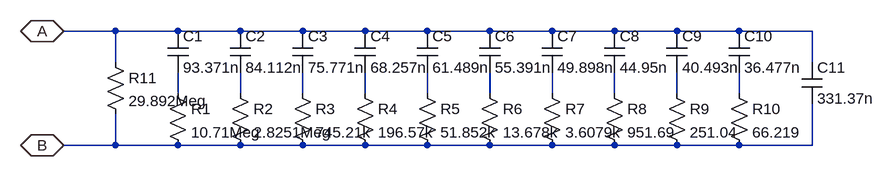
[diagram p0: schematic CPE1.asc]
CPE1.asc, the LTspice schematic file:
Version 4
SHEET 1 1212 680
WIRE 32 0 -48 0
WIRE 128 0 32 0
WIRE 224 0 128 0
WIRE 320 0 224 0
WIRE 416 0 320 0
WIRE 512 0 416 0
WIRE 608 0 512 0
WIRE 704 0 608 0
WIRE 800 0 704 0
WIRE 896 0 800 0
WIRE 992 0 896 0
WIRE 1104 0 992 0
WIRE 32 48 32 0
WIRE 1104 48 1104 0
WIRE 128 96 128 64
WIRE 224 96 224 64
WIRE 320 96 320 64
WIRE 416 96 416 64
WIRE 512 96 512 64
WIRE 608 96 608 64
WIRE 704 96 704 64
WIRE 800 96 800 64
WIRE 896 96 896 64
WIRE 992 96 992 64
WIRE 32 176 32 128
WIRE 32 176 -48 176
WIRE 128 176 32 176
WIRE 224 176 128 176
WIRE 320 176 224 176
WIRE 416 176 320 176
WIRE 512 176 416 176
WIRE 608 176 512 176
WIRE 704 176 608 176
WIRE 800 176 704 176
WIRE 896 176 800 176
WIRE 992 176 896 176
WIRE 1104 176 1104 112
WIRE 1104 176 992 176
FLAG -48 0 A
IOPIN -48 0 BiDir
FLAG -48 176 B
IOPIN -48 176 BiDir
SYMBOL res 112 80 R0
SYMATTR InstName R1
SYMATTR Value 10.71Meg
SYMBOL res 208 80 R0
SYMATTR InstName R2
SYMATTR Value 2.8251Meg
SYMBOL res 304 80 R0
SYMATTR InstName R3
SYMATTR Value 745.21k
SYMBOL res 400 80 R0
SYMATTR InstName R4
SYMATTR Value 196.57k
SYMBOL res 496 80 R0
SYMATTR InstName R5
SYMATTR Value 51.852k
SYMBOL res 592 80 R0
SYMATTR InstName R6
SYMATTR Value 13.678k
SYMBOL res 688 80 R0
SYMATTR InstName R7
SYMATTR Value 3.6079k
SYMBOL res 784 80 R0
SYMATTR InstName R8
SYMATTR Value 951.69
SYMBOL res 880 80 R0
SYMATTR InstName R9
SYMATTR Value 251.04
SYMBOL res 976 80 R0
SYMATTR InstName R10
SYMATTR Value 66.219
SYMBOL cap 112 0 R0
SYMATTR InstName C1
SYMATTR Value 93.371n
SYMBOL cap 208 0 R0
SYMATTR InstName C2
SYMATTR Value 84.112n
SYMBOL cap 304 0 R0
SYMATTR InstName C3
SYMATTR Value 75.771n
SYMBOL cap 400 0 R0
SYMATTR InstName C4
SYMATTR Value 68.257n
SYMBOL cap 496 0 R0
SYMATTR InstName C5
SYMATTR Value 61.489n
SYMBOL cap 592 0 R0
SYMATTR InstName C6
SYMATTR Value 55.391n
SYMBOL cap 688 0 R0
SYMATTR InstName C7
SYMATTR Value 49.898n
SYMBOL cap 784 0 R0
SYMATTR InstName C8
SYMATTR Value 44.95n
SYMBOL cap 880 0 R0
SYMATTR InstName C9
SYMATTR Value 40.493n
SYMBOL cap 976 0 R0
SYMATTR InstName C10
SYMATTR Value 36.477n
SYMBOL cap 1088 48 R0
SYMATTR InstName C11
SYMATTR Value 331.37n
SYMBOL res 16 32 R0
SYMATTR InstName R11
SYMATTR Value 29.892Meg

The netlist it stands for:
* CPE1.asc
R1 N001 B 10.71Meg
R2 N002 B 2.8251Meg
R3 N003 B 745.21k
R4 N004 B 196.57k
R5 N005 B 51.852k
R6 N006 B 13.678k
R7 N007 B 3.6079k
R8 N008 B 951.69
R9 N009 B 251.04
R10 N010 B 66.219
C1 A N001 93.371n
C2 A N002 84.112n
C3 A N003 75.771n
C4 A N004 68.257n
C5 A N005 61.489n
C6 A N006 55.391n
C7 A N007 49.898n
C8 A N008 44.95n
C9 A N009 40.493n
C10 A N010 36.477n
C11 A B 331.37n
R11 A B 29.892Meg
.backanno
.end